# EAGLE schematic MPU_2020 (EAGLE 9.3.0)
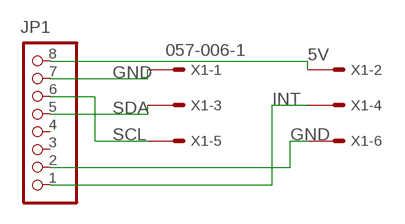
[diagram p0: schematic, sheet 1]

## Parts
JP1  PINHD-1X8  [1X08]
X1  057-006-1  [057-006-1]

## Nets
5V: JP1.8 X1.2
GND: JP1.2 JP1.7 X1.1 X1.6
INT: JP1.1 X1.4
SCL: JP1.6 X1.5
SDA: JP1.5 X1.3
Unconnected: JP1.3 JP1.4

## Library data of the parts
JP1 = pinhead:PINHD-1X8: PIN HEADER
X1 = con-panduit:057-006-: CONNECTOR 6-pin series 057 contact pc board low profile headers; OC_FARNELL: unknown; OC_NEWARK: unknown